# EAGLE design controller (EAGLE 6.5.0)
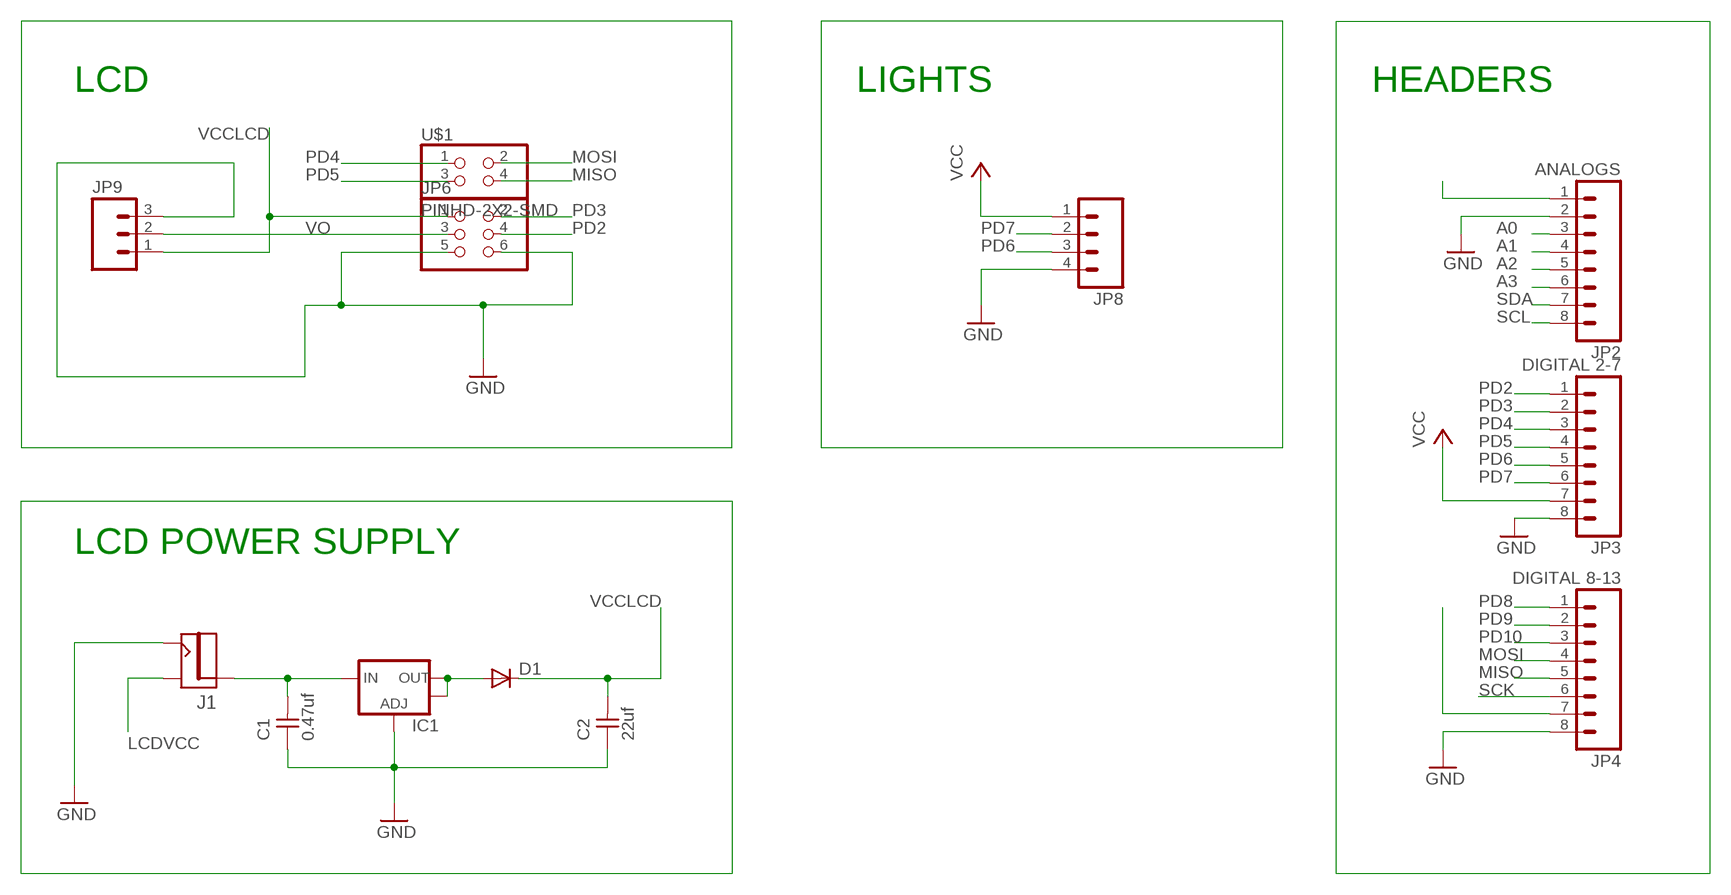
[diagram p0: schematic, sheet 1]

## Parts
C1  0.47uf  UNPOLARIZED_CAPACITOR1206  [1206]
C2  22uf  UNPOLARIZED_CAPACITOR1206  [1206]
D1  DIODESOD123  [SOD123]
IC1  V_REG_LM1117SOT223  [SOT223]
J1  JACK.65MM  [JACK_.65MM]
JP2  ANALOGS  M08  [1X08]
JP3  DIGITAL 2-7  M08  [1X08]
JP4  DIGITAL 8-13  M08  [1X08]
JP6  PINHD-2X3-SMD  [2X03SMD]
JP8  M04PTH  [1X04]
JP9  M03PTH  [1X03]
U$1  PINHD-2X2-SMD  [2X02SMD]

## Nets
A0: JP2.3
A1: JP2.4
A2: JP2.5
A3: JP2.6
GND: C1.1 C2.1 IC1.1(ADJ) J1.SHUNT(CONTACT) JP2.2 JP3.8 JP4.8 JP6.5 JP6.6 JP8.4 JP9.3
LCDVCC: J1.CONTACT(SHUNT)
MISO: JP4.5 U$1.4
MOSI: JP4.4 U$1.2
N$2: JP4.7
N$11: JP2.1
N$12: C1.2 IC1.3(IN) J1.PIN
N$20: D1.ANODE(A) IC1.2(OUT) IC1.4(OUT)
PD2: JP3.1 JP6.4
PD3: JP3.2 JP6.2
PD4: JP3.3 U$1.1
PD5: JP3.4 U$1.3
PD6: JP3.5 JP8.3
PD7: JP3.6 JP8.2
PD8: JP4.1
PD9: JP4.2
PD10: JP4.3
SCK: JP4.6
SCL: JP2.8
SDA: JP2.7
VCC: JP3.7 JP8.1
VCCLCD: C2.2 D1.CATHODE(C) JP6.1 JP9.1
VO: JP6.3 JP9.2

## Notes on the sheet
- LCD | LIGHTS | HEADERS
- LCD POWER SUPPLY

## Library data of the parts
C1 C2 = 01_ng:UNPOLARIZED_CAPACITOR: unpolarized_capacitor
D1 = 01_fab:DIODE: DIODE high speed (Philips)
IC1 = 01_SparkFun:V_REG_LM1117: Voltage Regulator LM1117 Standard adjustable voltage regulator but in SMD form. Spark Fun Electronics SKU : COM-00595
J1 = 01_fab:JACK
JP2-JP4 = 01_SparkFun:M08: Header 8 Standard 8-pin 0.1" header. Use with straight break away headers (SKU : PRT-00116), right angle break away headers (PRT-00553), swiss pins (PRT-00743), machine pins (PRT-00117), and female headers (PRT-00115).
JP6 = 01_fab:PINHD-2X3-SMD: PIN HEADER
JP8 = 01_SparkFun:M04: Header 4 Standard 4-pin 0.1" header. Use with straight break away headers (SKU : PRT-00116), right angle break away headers (PRT-00553), swiss pins (PRT-00743), machine pins (PRT-00117), and female headers (PRT-00115). Molex polarized connector foot print use with SKU : PRT-08231 with associated crimp pins and housings.
JP9 = 01_SparkFun:M03: Header 3 Standard 3-pin 0.1" header. Use with straight break away headers (SKU : PRT-00116), right angle break away headers (PRT-00553), swiss pins (PRT-00743), machine pins (PRT-00117), and female headers (PRT-00115). Molex polarized connector foot print use with SKU : PRT-08232 with associated crimp pins and housings.
U$1 = 01_fab:PINHD-2X2-SMD

## Board
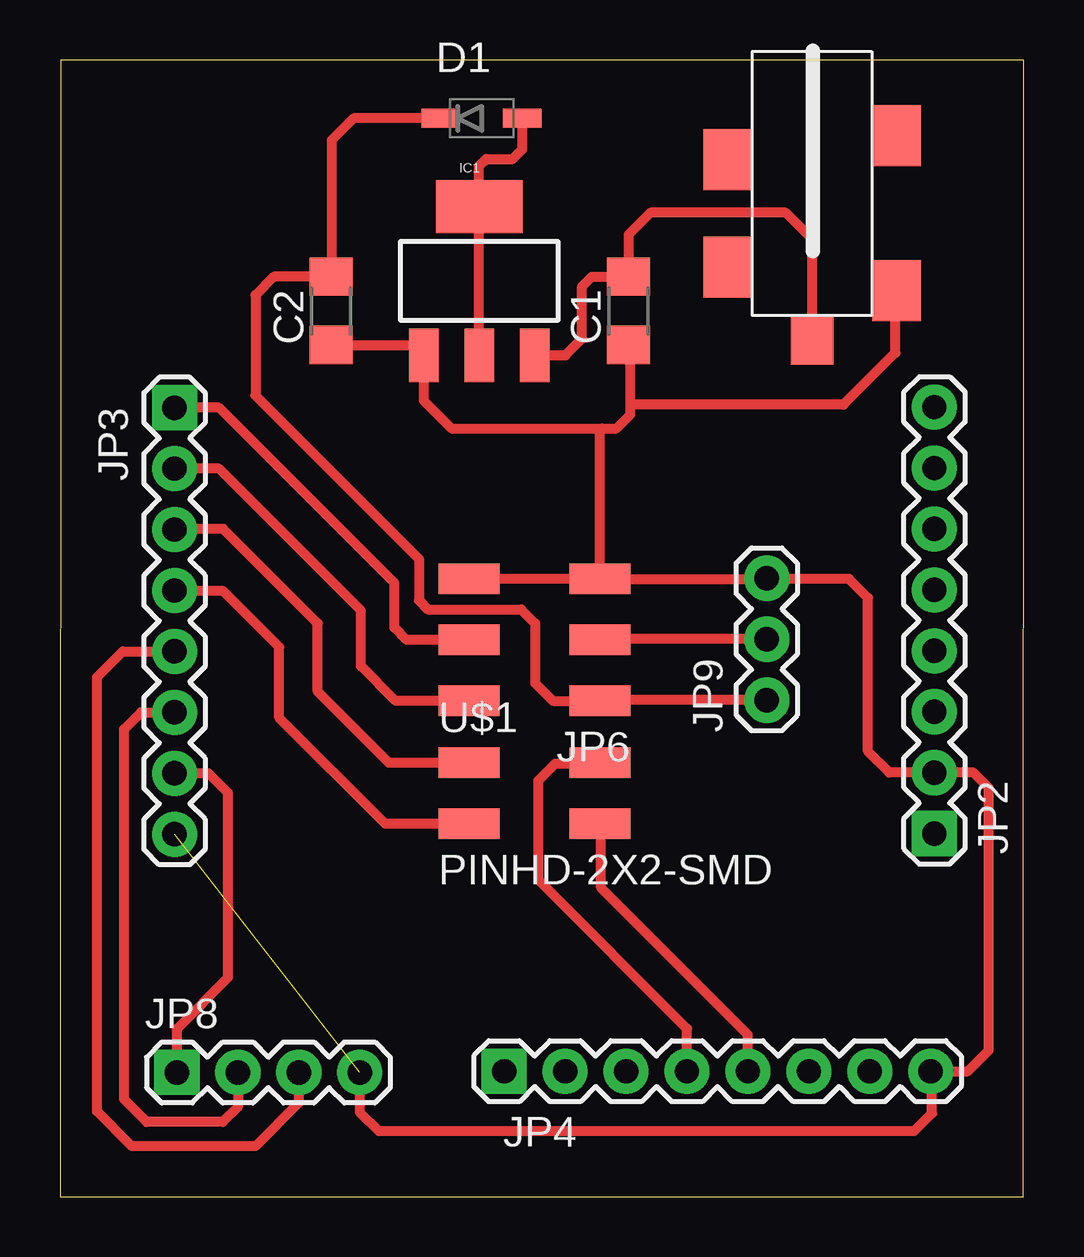
[diagram p1: board, top side]

Size 40.18 x 47.39 mm. Coordinates in mm from the lower left corner, seen from the top.
Outline: 0,0 40.16,0 40.18,47.39 0.03,47.39 0,0
Copper layers (1*16): Top 0.035mm / dielectric 1.5mm / Bottom 0.035mm
Design rules "default": minimum track width 10mil, minimum drill 24mil, track to track 8mil, track to pad 8mil, pad to pad 8mil, via to via 8mil, smd to smd 8mil, copper to edge 40mil, drill to drill 8mil, minimum pad ring 10mil, minimum via ring 8mil, stop-mask expansion 4mil, vias tented up to drill 0mil, thermal gap 10mil

### Footprints (pad centres in the part's own frame; a part is rotated, then mirrored left to right if it is on the bottom)
1206 = smd 1.6 x 1.803: 1 -1.422,0; 2 1.422,0
SOD123 = smd 1.6 x 0.8: ANODE 1.7,0; CATHODE -1.7,0
SOT223 = smd 1.219 x 2.235: 1 -2.311,-3.099; 2 0,-3.099; 3 2.311,-3.099 | smd 3.6 x 2.2: 4 0,3.099
JACK_.65MM = smd 2.032 x 2.54: CONTACT 3.578,4.026; SHIELD -3.45,-1.448; SHIELD1 3.578,-0.447; SHUNT -3.45,5.005 | smd 1.778 x 2.032: PIN 0.064,7.071
1X08 = drill 1.016 pad 1.88 square: 1 0,0 | drill 1.016 pad 1.88: 2 2.54,0; 3 5.08,0; 4 7.62,0; 5 10.16,0; 6 12.7,0; 7 15.24,0; 8 17.78,0
2X03SMD = smd 2.54 x 1.27: 1 -2.54,2.54; 2 2.92,2.54; 3 -2.54,0; 4 2.92,0; 5 -2.54,-2.54; 6 2.92,-2.54
1X04 = drill 1.016 pad 1.88 square: 1 0,0 | drill 1.016 pad 1.88: 2 2.54,0; 3 5.08,0; 4 7.62,0
1X03 = drill 1.016 pad 1.88: 1 0,0; 2 2.54,0; 3 5.08,0
2X02SMD = smd 2.54 x 1.27: 1 -2.54,1.27; 2 2.92,1.27; 3 -2.54,-1.27; 4 2.92,-1.27

### Placement (x,y rotation side)
C1  23.7,36.93 90 top
C2  11.3,36.93 90 top
D1  17.58,44.96 0 top
IC1  17.48,38.18 0 top
J1  31.42,42.77 180 top
JP2  36.45,15.14 90 top
JP3  4.78,32.89 270 top
JP4  18.52,5.23 0 top
JP6  19.96,23.22 180 top
JP8  4.88,5.18 0 top
JP9  29.46,20.7 90 top
U$1  19.58,16.81 0 top

### Tracks (layer width: path | path; a pad name or v marks a point on that pad's centre or on a via)
GND  (1 unrouted)
  Top 0.406: JP8.4 12.5,3.53 13.28,2.74 35.61,2.74 36.35,3.48 36.35,5.18 JP4.8 37.85,5.23 38.71,6.1 38.71,17.04 38.07,17.68 JP2.2 34.57,17.68 33.68,18.57 33.68,24.97 32.89,25.76 29.49,25.76 JP9.3 29.44,25.76 JP6.5 | JP6.5 JP6.6 | J1.SHUNT 34.82,37.72 34.82,35.18 32.66,33.02 23.8,33.02 23.77,33.05 | C2.1 14.73,35.51 IC1.1 15.16,33.2 16.33,32.03 22.61,32.03 | 22.61,32.03 23.19,32.03 23.77,32.61 23.77,33.05 | 23.77,33.05 23.77,35.43 C1.1 | JP6.5 22.5,31.93 22.61,32.03
MISO
  Top 0.406: JP4.5 28.68,6.76 22.56,12.88 22.56,15.49 U$1.4
MOSI
  Top 0.406: JP4.4 26.14,7.01 19.94,13.21 19.94,17.35 20.65,18.06 22.48,18.06 U$1.2
N$12
  Top 0.406: J1.PIN 31.36,39.92 30.25,41.02 24.61,41.02 23.7,40.11 C1.2 22.17,38.35 21.77,37.95 21.77,35.76 21.08,35.08 IC1.3
N$20
  Top 0.406: IC1.2 IC1.4 17.48,42.95 17.78,43.26 18.87,43.26 19.28,43.66 D1.ANODE
PD2
  Top 0.406: JP3.1 6.63,32.89 13.94,25.58 13.94,23.72 14.45,23.22 JP6.4
PD3
  Top 0.406: JP3.2 6.63,30.35 12.55,24.43 12.55,22.12 14,20.68 JP6.2
PD4
  Top 0.406: JP3.3 4.8,27.84 6.81,27.84 10.74,23.9 10.74,21.06 13.72,18.08 U$1.1
PD5
  Top 0.406: JP3.4 4.8,25.25 6.81,25.25 9.14,22.91 9.14,19.96 13.56,15.54 U$1.3
PD6
  Top 0.406: JP8.3 9.96,3.91 8.15,2.11 3,2.11 1.55,3.56 1.55,21.67 2.62,22.73 JP3.5
PD7
  Top 0.406: JP8.2 7.42,3.76 6.78,3.12 3.61,3.12 2.67,4.06 2.67,19.48 3.38,20.19 JP3.6
VCC
  Top 0.406: JP8.1 4.88,7.01 7.01,9.14 7.01,16.84 6.2,17.65 JP3.7
VCCLCD
  Top 0.406: D1.CATHODE 12.24,44.96 11.33,44.04 11.33,38.38 C2.2 8.92,38.35 8.15,37.59 8.15,33.4 14.96,26.59 14.96,24.87 15.34,24.49 19.23,24.49 19.81,23.9 19.81,21.41 20.55,20.68 JP6.1 22.53,20.7 JP9.1
VO
  Top 0.406: JP9.2 22.53,23.24 JP6.3